# Altium project Digital_Tape.PrjPcb
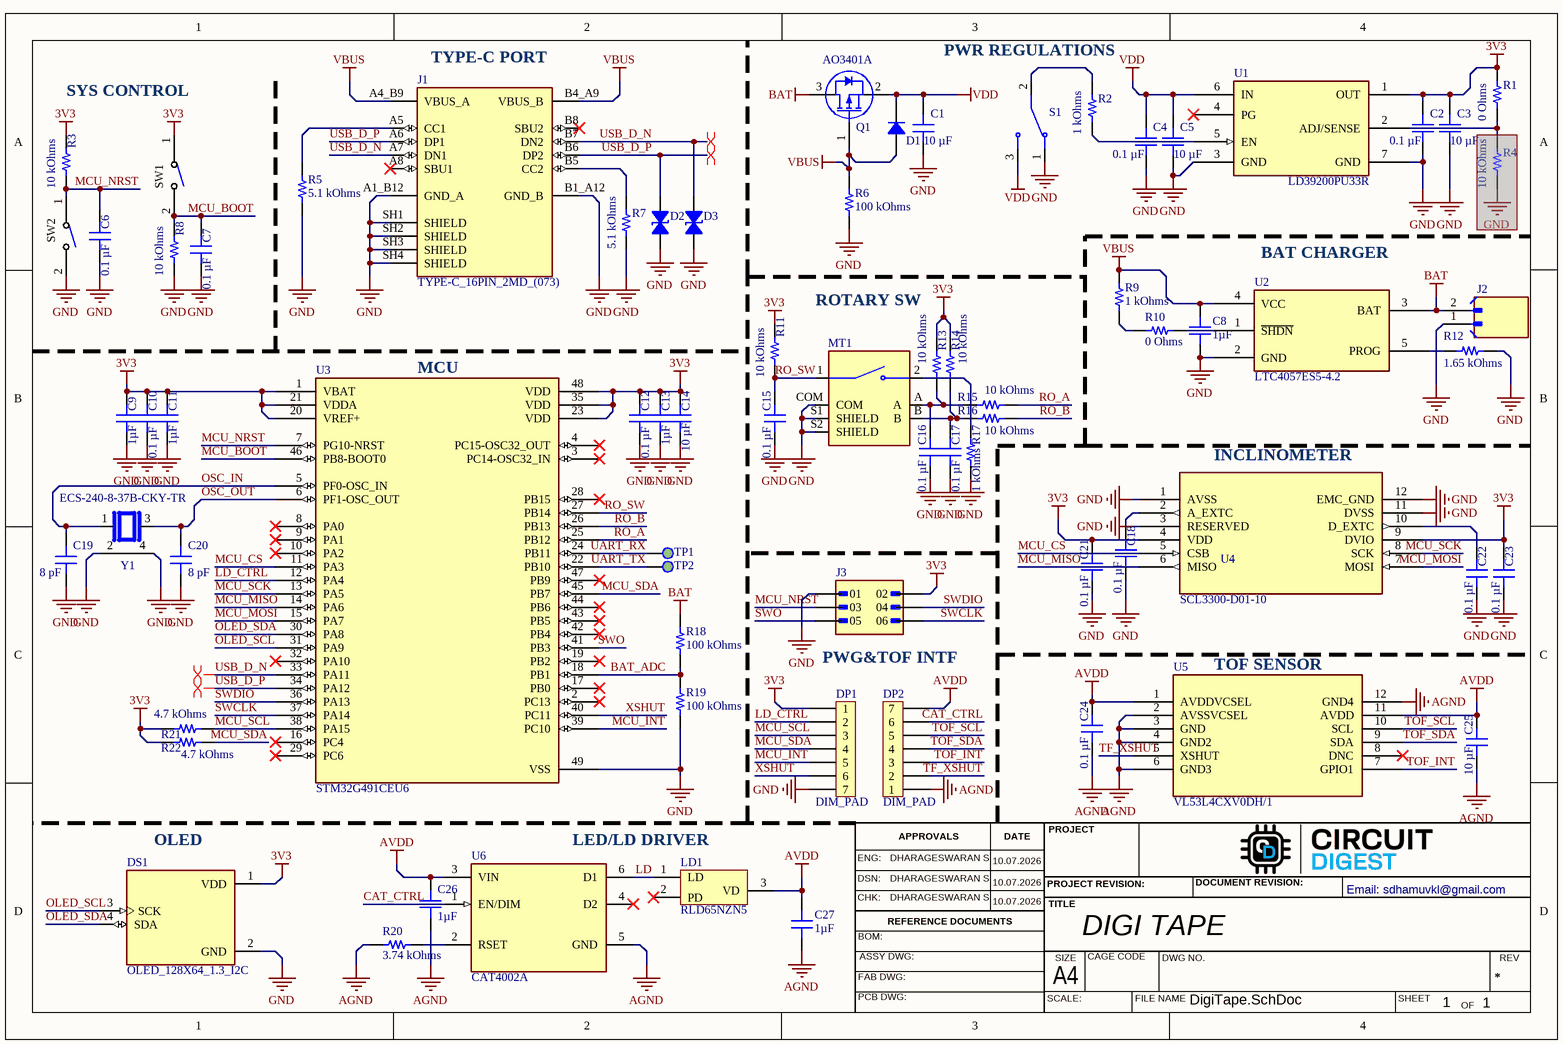
[diagram p0: DigiTape.SchDoc]
1 sheet, 73 parts. Net scope: global (net labels, ports and power ports of the same name join across sheets).
Board file: DigiTape.PcbDoc

## Sheet DigiTape.SchDoc: DIGI TAPE
size A4; Date: 10.07.2026; SheetNumber: 1; SheetTotal: 1

### Parts
C1  10 µF  [CAP 0603_1608]
C2  0.1 µF  [CAP 0603_1608]
C3  10 µF  [CAP 0603_1608]
C4  0.1 µF  [CAP 0603_1608]
C5  10 µF  [CAP 0603_1608]
C6  0.1 µF  [CAP 0603_1608]
C7  0.1 µF  [CAP 0603_1608]
C8  1µF  [CAP 0603_1608]
C9  1µF  [CAP 0603_1608]
C10  0.1 µF  [CAP 0603_1608]
C11  1µF  [CAP 0603_1608]
C12  0.1 µF  [CAP 0603_1608]
C13  1µF  [CAP 0603_1608]
C14  10 µF  [CAP 0603_1608]
C15  0.1 µF  [CAP 0603_1608]
C16  0.1 µF  [CAP 0603_1608]
C17  0.1 µF  [CAP 0603_1608]
C18  0.1 µF  [CAP 0603_1608]
C19  8 pF  [CAP 0603_1608]
C20  8 pF  [CAP 0603_1608]
C21  0.1 µF  [CAP 0603_1608]
C22  0.1 µF  [CAP 0603_1608]
C23  0.1 µF  [CAP 0603_1608]
C24  0.1 µF  [CAP 0603_1608]
C25  10 µF  [CAP 0603_1608]
C26  1µF  [CAP 0603_1608]
C27  1µF  [CAP 0603_1608]
D1  CUS10S30,H3F  [SOD323]  (value not drawn)
D2  GG0402060R3C2P  [0402]  (value not drawn)
D3  GG0402060R3C2P  [0402]  (value not drawn)
DP1  DIM_PAD  [DIM_PAD]
DP2  DIM_PAD  [DIM_PAD]
DS1  OLED_128X64_1.3_I2C  [LCD_OLED_128X64_1.3_I2C]
J1  TYPE-C_16PIN_2MD_(073)  [SHOUHAN_TYPE-C_16PIN_2MD_(073)]
J2  B2B-PH-K-S(LF)(SN)  [JST_B2B-PH-K-S(LF)(SN)]  (value not drawn)
J3  TSHC-103-D-171-16-264-F-LF  [MLE_TSHC-103-D-171-16-264-F-LF]  (value not drawn)
LD1  RLD65NZN5  [RLD65NZN5]
MT1  PEC11R-4215F-S0024  [XDCR_PEC11R-4215F-S0024]  (value not drawn)
Q1  AO3401A  [AO-SOT-23-3L_V]
R1  0 Ohms  [RES 0603_1608]
R2  1 kOhms  [RES 0603_1608]
R3  10 kOhms  [RES 0603_1608]
R4  10 kOhms  [RES 0402_1005]  (masked out: inside a compile mask, not in the netlist)
R5  5.1 kOhms  [RES 0603_1608]
R6  100 kOhms  [RES 0603_1608]
R7  5.1 kOhms  [RES 0603_1608]
R8  10 kOhms  [RES 0603_1608]
R9  1 kOhms  [RES 0603_1608]
R10  0 Ohms  [RES 0603_1608]
R11  10 kOhms  [RES 0603_1608]
R12  1.65 kOhms  [RES 0603_1608]
R13  10 kOhms  [RES 0603_1608]
R14  10 kOhms  [RES 0603_1608]
R15  10 kOhms  [RES 0603_1608]
R16  10 kOhms  [RES 0603_1608]
R17  1 kOhms  [RES 0603_1608]
R18  100 kOhms  [RES 0603_1608]
R19  100 kOhms  [RES 0603_1608]
R20  3.74 kOhms  [RES 0603_1608]
R21  4.7 kOhms  [RES 0603_1608]
R22  4.7 kOhms  [RES 0603_1608]
S1  EG1215AA  [SW_EG1215AA]  (value not drawn)
SW1  TS-1088-AR02016  [SW-SMD_L3.9-W3.0-P4.45]  (value not drawn)
SW2  TS-1088-AR02016  [SW-SMD_L3.9-W3.0-P4.45]  (value not drawn)
TP1  ROUND PAD 1.5MM  [ROUND PAD 1.5MM]  (value not drawn)
TP2  ROUND PAD 1.5MM  [ROUND PAD 1.5MM]  (value not drawn)
U1  LD39200PU33R  [SON_DFN6_3X3_STM]
U2  LTC4057ES5-4.2  [S_5_ADI]
U3  STM32G491CEU6  [QFPN_491CEU6_STM]
U4  SCL3300-D01-10  [SCL3300-D01-10_MUR]
U5  VL53L4CXV0DH/1  [LGA12_STM]
U6  CAT4002A  [CAT4002A]
Y1  ECS-240-8-37B-CKY-TR  [XTAL_ECS-160-9-37-CKM-TR]

### Nets
3V3: C2.2 C3.2 C9.2 C10.2 C11.2 C12.2 C13.2 C14.2 C21.2 C23.2 DP1.1 DS1.1(VDD) J3.02 R1.2 R3.2 R11.2 R13.2 R14.2 R21.2 R22.2 SW1.1 U1.1(OUT) U3.1(VBAT) U3.20(VREF+) U3.21(VDDA) U3.23(VDD) U3.35(VDD) U3.48(VDD) U4.4(VDD) U4.9(DVIO)
AGND: C24.1 C25.1 C26.1 C27.1 DP2.1 R20.1 U5.2(AVSSVCSEL) U5.3(GND) U5.4(GND2) U5.6(GND3) U5.12(GND4) U6.5(GND)
AVDD: C24.2 C25.2 C26.2 C27.2 DP2.7 LD1.3(VD) U5.1(AVDDVCSEL) U5.11(AVDD) U6.3(VIN)
BAT: J2.2 Q1.3(DRAIN) R18.2 U2.3(BAT)
GND: C1.1 C2.1 C3.1 C4.1 C5.1 C6.1 C7.1 C8.1 C9.1 C10.1 C11.1 C12.1 C13.1 C14.1 C15.1 C16.1 C17.1 C18.1 C19.1 C20.1 C21.1 C22.1 C23.1 D2.1 D3.1 DP1.7 DS1.2(GND) J1.A1_B12(GND_A) J1.B1_A12(GND_B) J1.SH1(SHIELD) J1.SH2(SHIELD) J1.SH3(SHIELD) J1.SH4(SHIELD) J2.1 J3.01 MT1.COM MT1.S1(SHIELD) MT1.S2(SHIELD) R5.1 R6.1 R7.1 R8.1 R12.1 R17.1 R19.1 S1.1 SW2.2 U1.3(GND) U1.7(GND) U2.2(GND) U3.49(VSS) U4.1(AVSS) U4.3(RESERVED) U4.11(DVSS) U4.12(EMC_GND) Y1.2 Y1.4
VBUS: C8.2 D1.1 J1.A4_B9(VBUS_A) J1.B4_A9(VBUS_B) Q1.1(GATE) R6.2 R9.2 U2.4(VCC)
VDD: C1.2 C4.2 C5.2 D1.2 Q1.2(SOURCE) S1.3 U1.6(IN)
BAT_ADC: R18.1 R19.2 U3.18(PB1)
CAT_CTRL: DP2.6 U6.1(EN/DIM)
LD: LD1.1(LD) U6.6(D1)
LD_CTRL: DP1.2 U3.12(PA4)
MCU_BOOT: C7.2 R8.2 SW1.2 U3.46(PB8-BOOT0)
MCU_CS: U3.11(PA3) U4.5(CSB)
MCU_INT: DP1.5 U3.39(PC10)
MCU_MISO: U3.14(PA6) U4.6(MISO)
MCU_MOSI: U3.15(PA7) U4.7(MOSI)
MCU_NRST: C6.2 J3.03 R3.1 SW2.1 U3.7(PG10-NRST)
MCU_SCK: U3.13(PA5) U4.8(SCK)
MCU_SCL: DP1.3 R21.1 U3.38(PA15)
MCU_SDA: DP1.4 R22.1 U3.45(PB7)
OLED_SCL: DS1.3(SCK) U3.31(PA9)
OLED_SDA: DS1.4(SDA) U3.30(PA8)
OSC_IN: C19.2 U3.5(PF0-OSC_IN) Y1.1
OSC_OUT: C20.2 U3.6(PF1-OSC_OUT) Y1.3
RO_A: R15.2 U3.25(PB12)
RO_B: R16.2 U3.26(PB13)
RO_SW: C15.2 MT1.1 R11.1 U3.27(PB14)
SWCLK: J3.06 U3.37(PA14)
SWDIO: J3.04 U3.36(PA13)
SWO: J3.05 U3.41(PB3)
TF_XSHUT: DP2.2 U5.5(XSHUT)
TOF_INT: DP2.3 U5.7(GPIO1)
TOF_SCL: DP2.5 U5.10(SCL)
TOF_SDA: DP2.4 U5.9(SDA)
UART_RX: TP1.1 U3.24(PB11)
UART_TX: TP2.1 U3.22(PB10)
USB_D_N: D3.2 J1.A7(DN1) J1.B7(DN2) U3.33(PA11)
USB_D_P: D2.2 J1.A6(DP1) J1.B6(DP2) U3.34(PA12)
XSHUT: DP1.6 U3.40(PC11)
NetC16_2: C16.2 MT1.A R13.1 R15.1
NetC17_2: C17.2 MT1.B R14.1 R16.1
NetC18_2: C18.2 U4.2(A_EXTC)
NetC22_2: C22.2 U4.10(D_EXTC)
NetJ1_A5: J1.A5(CC1) R5.2
NetJ1_B5: J1.B5(CC2) R7.2
NetMT1_2: MT1.2 R17.2
NetR1_1: R1.1 U1.2(ADJ/SENSE)
NetR2_1: R2.1 U1.5(EN)
NetR2_2: R2.2 S1.2
NetR9_1: R9.1 R10.1
NetR10_2: R10.2 U2.1(~{SHDN})
NetR12_2: R12.2 U2.5(PROG)
NetR20_2: R20.2 U6.2(RSET)

Not connected (* = marked no-connect by the designer): J1 A8(SBU1)* B8(SBU2)*; LD1 2(PD)*; U1 4(PG)*; U3 2(PC13)* 3(PC14-OSC32_IN)* 4(PC15-OSC32_OUT)* 8(PA0)* 9(PA1)* 10(PA2)* 16(PC4)* 17(PB0)* 19(PB2)* 28(PB15)* 29(PC6)* 32(PA10)* 42(PB4)* 43(PB5)* 44(PB6)* 47(PB9)*; U5 8(DNC)*; U6 4(D2)*

### Layout directives
differential pair: USB_D_N, USB_D_P

### Notes on the sheet
- SYS CONTROL
- (near J1) TYPE-C PORT
- PWR REGULATIONS
- (near U2) BAT CHARGER
- ROTARY SW
- (near U3) MCU
- (near U4) INCLINOMETER
- PWG&TOF INTF
- (near U5) TOF SENSOR
- (near DS1) OLED
- LED/LD DRIVER
- ENG:
- DHARAGESWARAN S
- APPROVALS
- DATE
- PROJECT
- DSN:
- CHK:
- REFERENCE DOCUMENTS
- PROJECT REVISION:
- TITLE
- DOCUMENT REVISION:
- Email: sdhamuvkl@gmail.com <https://github.com/DhamuVkl>
- BOM:
- FAB DWG:
- PCB DWG:
- ASSY DWG:
- SCALE:
- A4
- SIZE
- CAGE CODE
- FILE NAME
- DWG NO.
- SHEET
- REV
- OF

### Library data of the parts
C1 C3 C5 C14 C25 = GMC10X7R106M6R3NT: CAP0603 X7R 10UF 20% 6.3V; Manufacturer: Cal-Chip Electronics, Inc.; id: 9373; Part Number: GMC10X7R106M6R3NT; Value: 10 µF; Temperature Coefficient: X7R; Supplier Part Number 1: 4713-GMC10X7R106M6R3NTCT-ND; ComponentLink2Description: DigiKey Link; ComponentLink1URL: https://88ce57.p3cdn1.secureserver.net/wp-content/uploads/2023/01/gmc_series-2.pdf; PartId: 49831; Tolerance: ±20%; Supplier 1: DigiKey; Series: GMC; LastUpdated: 2023-04-21T19:07:51.070; Part Status: Active; Capacitance: 10 µF; Device Package: 0603 (1608 Metric); Thickness (Max): 0.039" (1.00mm); Voltage - Rated: 6.3V; Minimum Order: 1; Packaging: TapeAndReel; Applications: General Purpose; Package / Case: 0603 (1608 Metric); ComponentLink1Description: Datasheet; Price: 0.14; ComponentLink2URL: https://www.digikey.com/en/products/detail/cal-chip-electronics-inc/GMC10X7R106M6R3NT/18151153; Lifecycle Status: Active; Operating Temperature: -55°C ~ 125°C; Size / Dimension: 0.063" L x 0.031" W (1.60mm x 0.80mm); Mounting Type: Surface Mount, MLCC
C2 C4 C6 C7 C10 C12 C15-C18 C21-C24 = CS0603KRX7R7BB104: CAP CER 0.1UF 16V X7R 0603; Manufacturer: Yageo; id: 56; Tolerance: ±10%; Part Number: CS0603KRX7R7BB104; Value: 0.1 µF; Temperature Coefficient: X7R; Supplier Part Number 1: 311-3560-1-ND; ComponentLink2Description: DigiKey Link; ComponentLink1URL: http://www.yageo.com/NewPortal/yageodocoutput?fileName=/pdf/MLCC/UPY-ST_NPOX7R_16V-to-3KV_5.pdf; PartId: 2286; Supplier 1: DigiKey; Series: CS; LastUpdated: 2023-01-03T20:07:47.973; Part Status: Active; Capacitance: 0.1 µF; Device Package: 0603 (1608 Metric); Thickness (Max): 0.037" (0.95mm); Voltage - Rated: 16V; Minimum Order: 1; Packaging: TapeAndReel; Applications: Boardflex Sensitive; Package / Case: 0603 (1608 Metric); ComponentLink1Description: Datasheet; Price: 0.02; ComponentLink2URL: https://www.digikey.com/en/products/detail/yageo/CS0603KRX7R7BB104/6097897; Lifecycle Status: Active; Operating Temperature: -55°C ~ 125°C; Size / Dimension: 0.063" L x 0.031" W (1.60mm x 0.80mm); Mounting Type: Surface Mount, MLCC; Features: Soft Termination
C8 C9 C11 C13 C26 C27 = 0603ZG105ZAT2A: CAP CER 1UF 10V Y5V 0603; Manufacturer: AVX Corporation; id: 522; Temperature Coefficient: Y5V (F); Tolerance: -20%, +80%; Part Number: 0603ZG105ZAT2A; Value: 1µF; Supplier Part Number 1: 478-1265-1-ND; ComponentLink2Description: DigiKey Link; ComponentLink1URL: http://datasheets.avx.com/Y5V.pdf; PartId: 4251; Supplier 1: DigiKey; Series: -; LastUpdated: 2020-09-02T01:03:32.277; Part Status: Active; Capacitance: 1µF; Device Package: 0603 (1608 Metric); Thickness (Max): 0.035" (0.90mm); Voltage - Rated: 10V; Minimum Order: 1; Packaging: TapeAndReel; Applications: General Purpose; Package / Case: 0603 (1608 Metric); ComponentLink1Description: Datasheet; Price: 0.02; ComponentLink2URL: http://digikey.com/product-detail/en/avx-corporation/0603ZG105ZAT2A/478-1265-1-ND/564297; Lifecycle Status: Active; Operating Temperature: -30°C ~ 85°C; Size / Dimension: 0.063" L x 0.032" W (1.60mm x 0.81mm); Mounting Type: Surface Mount, MLCC
C19 C20 = CGA3E2C0G1H080D080AD: CAP CER 8PF 50V 0603 EPOXY; Manufacturer: TDK Corporation; id: 983; Temperature Coefficient: C0G, NP0; Tolerance: ±0.5pF; Part Number: CGA3E2C0G1H080D080AD; Value: 8 pF; Supplier Part Number 1: 445-9807-1-ND; ComponentLink2Description: DigiKey Link; ComponentLink1URL: https://product.tdk.com/info/en/catalog/datasheets/mlcc_automotive_epoxy_en.pdf?ref_disty=digikey; PartId: 6342; Supplier 1: DigiKey; Series: CGA; LastUpdated: 2023-01-03T20:07:37.107; Part Status: Active; Capacitance: 8 pF; Device Package: 0603 (1608 Metric); Ratings: AEC-Q200; Thickness (Max): 0.037" (0.95mm); Voltage - Rated: 50V; Minimum Order: 1; Packaging: TapeAndReel; Applications: Automotive; Package / Case: 0603 (1608 Metric); ComponentLink1Description: Datasheet; Price: 0.02; ComponentLink2URL: https://www.digikey.com/en/products/detail/tdk-corporation/CGA3E2C0G1H080D080AD/3933540; Lifecycle Status: Active; Operating Temperature: -55°C ~ 125°C; Size / Dimension: 0.063" L x 0.031" W (1.60mm x 0.80mm); Mounting Type: Surface Mount, MLCC, Epoxy; Features: Epoxy Mountable
D1 = CUS10S30,H3F: DIODE SCHOTTKY 30V 1A USC; Manufacturer: Toshiba Semiconductor and Storage; id: 3067; Capacitance @ Vr, F: 135pF @ 0V, 1MHz; Speed: Fast Recovery =< 500ns, > 200mA (Io); Voltage - Forward (Vf) (Max) @ If: 230 mV @ 100 mA; Current - Reverse Leakage @ Vr: 500 µA @ 30 V; Part Number: CUS10S30,H3F; Supplier Part Number 1: CUS10S30H3FCT-ND; Supplier Device Package: USC; ComponentLink1Description: Datasheet; ComponentLink2URL: https://www.digikey.com/en/products/detail/toshiba-semiconductor-and-storage/CUS10S30-H3F/5114299; ComponentLink1URL: https://toshiba.semicon-storage.com/info/docget.jsp?did=14077&prodName=CUS10S30; Supplier 1: DigiKey; Series: -; Part Status: Active; ComponentLink2Description: DigiKey Link; Current - Average Rectified (Io): 1A; Operating Temperature - Junction: 125°C (Max); Diode Type: Schottky; Packaging: TapeAndReel; Minimum Order: 1; Voltage - DC Reverse (Vr) (Max): 30 V; Package / Case: SC-76, SOD-323; PartId: 3067; Lifecycle Status: Active; LastUpdated: 2023-01-02T21:07:53.950; Mounting Type: Surface Mount; Price: 0.05
D2 D3 = GG0402060R3C2P: TVS DIODE 6.5VWM 15.5VC 0402; Manufacturer: KYOCERA AVX; id: 6041; Voltage - Breakdown (Min): 7V; Voltage - Reverse Standoff (Typ): 6.5V; Voltage - Clamping (Max) @ Ipp: 15.5V; Power Line Protection: No; Bidirectional Channels: 1; Capacitance @ Frequency: 0.3pF @ 1MHz; Type: Zener; Current - Peak Pulse (10/1000µs): 3A (8/20µs); Power - Peak Pulse: 54W; Part Number: GG0402060R3C2P; Supplier Part Number 1: 478-GG0402060R3C2PCT-ND; Supplier Device Package: 0402; ComponentLink1Description: Datasheet; ComponentLink2URL: https://www.digikey.com/en/products/detail/kyocera-avx/GG0402060R3C2P/13557242; ComponentLink1URL: https://datasheets.kyocera-avx.com/AVX-GiGuard.pdf; Supplier 1: DigiKey; Series: GiGUARD; Part Status: Active; ComponentLink2Description: DigiKey Link; Device Package: 0402 (1005 Metric); Packaging: TapeAndReel; Minimum Order: 1; Applications: Ethernet, HDMI, USB; Package / Case: 0402 (1005 Metric); PartId: 11515; Lifecycle Status: Active; LastUpdated: 2023-01-02T21:10:15.003; Operating Temperature: -55°C ~ 125°C; Mounting Type: Surface Mount; Price: 0.03
DS1 = OLED_128X64_1.3_I2C: Non-Touch Graphic LCD Display Module Transmissive White OLED, Monochrome I2C 1.3 (33.02mm) 128 x 64; MF: UNIVERSAL-SOLDER Electronics Ltd; MP: OLED 128x64 1.3&quot; I2C; SnapEDA_Link: https://www.snapeda.com/parts/OLED%20128x64%201.3%22%20I2C/UNIVERSAL-SOLDER+Electronics+Ltd/view-part/?ref=snap; Package: None; Value: *; Check_prices: https://www.snapeda.com/parts/OLED%20128x64%201.3%22%20I2C/UNIVERSAL-SOLDER+Electronics+Ltd/view-part/?ref=eda
J1 = TYPE-C_16PIN_2MD_(073): DC-5V 5A Type C USB; MF: Shouhan; MP: TYPE-C 16PIN 2MD (073); SnapEDA_Link: https://www.snapeda.com/parts/TYPE-C%2016PIN%202MD%20(073)/Shouhan/view-part/?ref=snap; Package: Package; Value: *; Check_prices: https://www.snapeda.com/parts/TYPE-C%2016PIN%202MD%20(073)/Shouhan/view-part/?ref=eda
J2 = B2B-PH-K-S(LF)(SN): Connector Header Through Hole 2 position 0.079 (2.00mm); MF: JST; SnapEDA_Link: https://www.snapeda.com/parts/B2B-PH-K-S%20(LF)(SN)/JST/view-part/?ref=snap; Package: None; Value: *; MP: B2B-PH-K-S (LF)(SN); Check_prices: https://www.snapeda.com/parts/B2B-PH-K-S%20(LF)(SN)/JST/view-part/?ref=eda
J3 = TSHC-103-D-171-16-264-F-LF: 6 Position Dual Row (3x2) 2.54mm Pitch Non-Shrouded Header; MF: Major League Electronics; SnapEDA_Link: https://www.snapeda.com/parts/TSHC-103-D-171-16-264-F-LF/Major+League+Electronics/view-part/?ref=snap; Package: None; Value: *; MP: TSHC-103-D-171-16-264-F-LF; Check_prices: https://www.snapeda.com/parts/TSHC-103-D-171-16-264-F-LF/Major+League+Electronics/view-part/?ref=eda
MT1 = PEC11R-4215F-S0024: Incremental Encoder, 12 Mm, Contact Rating 10 Ma - 5 Vdc; Price: None; Availability: Unavailable; MP: PEC11R-4215F-S0024; Value: *; Package: None
Q1 = CMP-2000-05778-1: P-Channel MOSFET, 30 V, 4 A, -55 to 150 degC, 3-Pin SOT-23-3L, RoHS, Tape and Reel; Manufacturer: Alpha and Omega; Output Power (Max): NotRequiredW; Power Dissipation: 1.4W; Rad Hardened: No; Drain Efficiency: NotRequired%; Drain-Source On-Volt: 30V; Noise Figure: NotRequireddB; Frequency (Max): NotRequiredMHz; Number of  Elements: 1; Gate-Source Voltage (Max): ?12V; Drain Current (Max): 4A; Channel Mode: Enhancement; Drain-Source On-Res: 0.044ohm; Type: PowerMOSFET; Polarity: P; Package URL: http://www.aosmd.com/res/packaging_information/SOT-23-3L.pdf; Datasheet URL: http://www.aosmd.com/res/data_sheets/AO3401A.pdf; Package Type: SOT-23; Package Description: 3-Pin Small Outline Transistor, Body 2.95 x 1.6 mm, Pitch 0.95 mm; Mounting: SurfaceMount; Manufacturer URL: http://www.aosmd.com/; Continuous Drain Current: 4A; Package Reference: SOT-23-3L; Mounting Technology: SurfaceMount; Operating Temperature Classification: Military; Power Gain: NotRequireddB; Datasheet Version: Rev. 3, 03/2011; Operating Temp Range: -55Cto150C; Pin Count: 3
R1 = RT0603BRD0756KL: RES SMD 56K OHM 0.1% 1/10W 0603; Manufacturer: Yageo; id: 2137; Temperature Coefficient: ±25ppm/°C; Value: 56 kOhms; Power (Watts): 0.1W, 1/10W; Part Number: RT0603BRD0756KL; Height - Seated (Max): 0.022" (0.55mm); Supplier Part Number 1: YAG4576CT-ND; Supplier Device Package: 0603; ComponentLink1Description: Datasheet; ComponentLink2URL: https://www.digikey.com/en/products/detail/yageo/RT0603BRD0756KL/1072582; ComponentLink1URL: https://www.yageo.com/upload/media/product/productsearch/datasheet/rchip/PYu-RT_1-to-0.01_RoHS_L_11.pdf; Composition: Thin Film; Tolerance: ±0.1%; Supplier 1: DigiKey; Series: RT; Part Status: Active; ComponentLink2Description: DigiKey Link; Device Package: 0603 (1608 Metric); Packaging: TapeAndReel; Minimum Order: 1; Package / Case: 0603 (1608 Metric); PartId: 9254; Lifecycle Status: Active; LastUpdated: 2023-01-02T20:30:09.580; Operating Temperature: -55°C ~ 155°C; Number Of Terminations: 2; Size / Dimension: 0.063" L x 0.031" W (1.60mm x 0.80mm); Price: 0.04; Resistance: 56 kOhms
R2 R9 R17 = CPF0603B1K0E: RES SMD 1K OHM 0.1% 1/16W 0603; Manufacturer: TE Connectivity Passive Product; id: 16; Temperature Coefficient: ±25ppm/°C; Power (Watts): 0.063W, 1/16W; Part Number: CPF0603B1K0E; Height - Seated (Max): 0.022" (0.55mm); Supplier Part Number 1: A119887CT-ND; Supplier Device Package: 0603; ComponentLink1Description: Datasheet; ComponentLink2URL: https://www.digikey.com/en/products/detail/te-connectivity-passive-product/CPF0603B1K0E/2390473; ComponentLink1URL: https://www.te.com/commerce/DocumentDelivery/DDEController?Action=srchrtrv&DocNm=1773200&DocType=DS&DocLang=English; Composition: Thin Film; Tolerance: ±0.1%; Supplier 1: DigiKey; Series: CPF, Neohm; Part Status: Active; ComponentLink2Description: DigiKey Link; Device Package: 0603 (1608 Metric); Packaging: TapeAndReel; Minimum Order: 1; Package / Case: 0603 (1608 Metric); PartId: 4877; Lifecycle Status: Active; LastUpdated: 2023-01-02T20:30:26.897; Operating Temperature: -55°C ~ 155°C; Number Of Terminations: 2; Value: 1 kOhms; Size / Dimension: 0.061" L x 0.031" W (1.55mm x 0.80mm); Price: 0.09; Resistance: 1 kOhms
R3 R8 R11 R13-R16 = RNCS0603BKE10K0: RES 10K OHM 0.1% 1/16W 0603; Manufacturer: Stackpole Electronics Inc; id: 1; Temperature Coefficient: ±25ppm/°C; Power (Watts): 0.063W, 1/16W; Part Number: RNCS0603BKE10K0; Height - Seated (Max): 0.022" (0.55mm); Supplier Part Number 1: RNCS0603BKE10K0CT-ND; Supplier Device Package: 0603; ComponentLink1Description: Datasheet; ComponentLink2URL: https://www.digikey.com/en/products/detail/stackpole-electronics-inc/RNCS0603BKE10K0/1708836; ComponentLink1URL: https://www.seielect.com/catalog/sei-rncs_rnch.pdf; Composition: Thin Film; Tolerance: ±0.1%; Supplier 1: DigiKey; Series: RNCS; Part Status: Active; ComponentLink2Description: DigiKey Link; Device Package: 0603 (1608 Metric); Packaging: TapeAndReel; Minimum Order: 1; Package / Case: 0603 (1608 Metric); PartId: 4838; Lifecycle Status: Active; LastUpdated: 2023-01-02T20:30:27.037; Operating Temperature: -55°C ~ 155°C; Number Of Terminations: 2; Value: 10 kOhms; Size / Dimension: 0.061" L x 0.031" W (1.55mm x 0.80mm); Price: 0.07; Resistance: 10 kOhms; Features: Anti-Corrosive, Automotive AEC-Q200, Moisture Resistant; Ratings: AEC-Q200
R4 = RT0402BRE0710KL: RES SMD 10K OHM 0.1% 1/16W 0402; Manufacturer: Yageo; id: 1919; Temperature Coefficient: ±50ppm/°C; Power (Watts): 0.063W, 1/16W; Part Number: RT0402BRE0710KL; Height - Seated (Max): 0.014" (0.35mm); Supplier Part Number 1: YAG2305CT-ND; Supplier Device Package: 0402; ComponentLink1Description: Datasheet; ComponentLink2URL: https://www.digikey.com/en/products/detail/yageo/RT0402BRE0710KL/1069451; ComponentLink1URL: https://www.yageo.com/upload/media/product/productsearch/datasheet/rchip/PYu-RT_1-to-0.01_RoHS_L_11.pdf; Composition: Thin Film; Tolerance: ±0.1%; Supplier 1: DigiKey; Series: RT; Part Status: Active; ComponentLink2Description: DigiKey Link; Device Package: 0402 (1005 Metric); Packaging: TapeAndReel; Minimum Order: 1; Package / Case: 0402 (1005 Metric); PartId: 6060; Lifecycle Status: Active; LastUpdated: 2023-01-02T20:21:36.193; Operating Temperature: -55°C ~ 155°C; Number Of Terminations: 2; Value: 10 kOhms; Size / Dimension: 0.039" L x 0.020" W (1.00mm x 0.50mm); Price: 0.04; Resistance: 10 kOhms
R5 R7 = RMCF0603JG5K10: RES 5.1K OHM 5% 1/10W 0603; Manufacturer: Stackpole Electronics Inc; id: 158; Temperature Coefficient: ±200ppm/°C; Power (Watts): 0.1W, 1/10W; Part Number: RMCF0603JG5K10; Height - Seated (Max): 0.022" (0.55mm); Supplier Part Number 1: RMCF0603JG5K10CT-ND; Supplier Device Package: 0603; ComponentLink1Description: Datasheet; ComponentLink2URL: https://www.digikey.com/en/products/detail/stackpole-electronics-inc/RMCF0603JG5K10/1712287; Features: Automotive AEC-Q200; ComponentLink1URL: https://www.seielect.com/catalog/sei-packaging.pdf; Composition: Thick Film; Tolerance: ±5%; Supplier 1: DigiKey; Series: RMCF; Part Status: Active; ComponentLink2Description: DigiKey Link; Device Package: 0603 (1608 Metric); Packaging: CutTape; Ratings: AEC-Q200; Minimum Order: 1; Package / Case: 0603 (1608 Metric); PartId: 5180; Lifecycle Status: Active; LastUpdated: 2023-01-02T20:30:25.707; Operating Temperature: -55°C ~ 155°C; Number Of Terminations: 2; Value: 5.1 kOhms; Size / Dimension: 0.061" L x 0.031" W (1.55mm x 0.80mm); Price: 0.01; Resistance: 5.1 kOhms
R6 R18 R19 = RNCS0603BKE100K: RES 100K OHM 0.1% 1/16W 0603; Manufacturer: Stackpole Electronics Inc; id: 6; Temperature Coefficient: ±25ppm/°C; Power (Watts): 0.063W, 1/16W; Part Number: RNCS0603BKE100K; Height - Seated (Max): 0.022" (0.55mm); Supplier Part Number 1: RNCS0603BKE100KCT-ND; Supplier Device Package: 0603; ComponentLink1Description: Datasheet; ComponentLink2URL: https://www.digikey.com/en/products/detail/stackpole-electronics-inc/RNCS0603BKE100K/1708835; Features: Anti-Corrosive, Automotive AEC-Q200, Moisture Resistant; ComponentLink1URL: https://www.seielect.com/catalog/sei-rncs_rnch.pdf; Composition: Thin Film; Tolerance: ±0.1%; Supplier 1: DigiKey; Series: RNCS; Part Status: Active; ComponentLink2Description: DigiKey Link; Device Package: 0603 (1608 Metric); Packaging: TapeAndReel; Ratings: AEC-Q200; Minimum Order: 1; Package / Case: 0603 (1608 Metric); PartId: 4849; Lifecycle Status: Active; LastUpdated: 2023-01-02T20:30:27; Operating Temperature: -55°C ~ 155°C; Number Of Terminations: 2; Value: 100 kOhms; Size / Dimension: 0.061" L x 0.031" W (1.55mm x 0.80mm); Price: 0.08; Resistance: 100 kOhms
R10 = PA0603-R-070RL: RES 0 OHM JUMPER 1/10W 0603; Manufacturer: Yageo; id: 11; Power (Watts): 0.1W, 1/10W; Temperature Coefficient: ±150ppm/°C; Part Number: PA0603-R-070RL; Height - Seated (Max): 0.024" (0.60mm); Supplier Part Number 1: YAG5757CT-ND; Supplier Device Package: 0603; ComponentLink1Description: Datasheet; ComponentLink2URL: https://www.digikey.com/en/products/detail/yageo/PA0603-R-070RL/8255972; Features: Automotive AEC-Q200, Current Sense; ComponentLink1URL: http://www.yageo.com/NewPortal/_en/search/productDocs.jsp?YageoPartNumber=PA0603-R-070RL; Composition: Metal Element; Tolerance: Jumper; Supplier 1: DigiKey; Series: PA; Part Status: Active; ComponentLink2Description: DigiKey Link; Device Package: 0603 (1608 Metric); Packaging: TapeAndReel; Minimum Order: 1; Package / Case: 0603 (1608 Metric); PartId: 4862; Lifecycle Status: Active; LastUpdated: 2023-01-02T20:30:26.940; Operating Temperature: -55°C ~ 155°C; Number Of Terminations: 2; Value: 0 Ohms; Size / Dimension: 0.063" L x 0.031" W (1.60mm x 0.80mm); Price: 0.08; Resistance: 0 Ohms
R12 = RC0603FR-071K65L: RES 1.65K OHM 1% 1/10W 0603; Manufacturer: Yageo; id: 1322; Temperature Coefficient: ±100ppm/°C; Power (Watts): 0.1W, 1/10W; Part Number: RC0603FR-071K65L; Height - Seated (Max): 0.022" (0.55mm); Supplier Part Number 1: 311-1.65KHRCT-ND; Supplier Device Package: 0603; ComponentLink1Description: Datasheet; ComponentLink2URL: https://www.digikey.com/en/products/detail/yageo/RC0603FR-071K65L/726870; Features: Moisture Resistant; ComponentLink1URL: https://www.yageo.com/upload/media/product/productsearch/datasheet/rchip/PYu-RC_Group_51_RoHS_L_10.pdf; Composition: Thick Film; Tolerance: ±1%; Supplier 1: DigiKey; Series: RC_L; Part Status: Active; ComponentLink2Description: DigiKey Link; Device Package: 0603 (1608 Metric); Packaging: CutTape; Minimum Order: 1; Package / Case: 0603 (1608 Metric); PartId: 7585; Lifecycle Status: Active; LastUpdated: 2023-01-02T20:30:16.083; Operating Temperature: -55°C ~ 155°C; Number Of Terminations: 2; Value: 1.65 kOhms; Size / Dimension: 0.063" L x 0.031" W (1.60mm x 0.80mm); Price: 0.01; Resistance: 1.65 kOhms
R20 = RNCF0603DTE3K74: RES 3.74K OHM 0.5% 1/10W 0603; Manufacturer: Stackpole Electronics Inc; id: 236; Temperature Coefficient: ±25ppm/°C; Power (Watts): 0.1W, 1/10W; Part Number: RNCF0603DTE3K74; Height - Seated (Max): 0.022" (0.55mm); Supplier Part Number 1: RNCF0603DTE3K74CT-ND; Supplier Device Package: 0603; ComponentLink1Description: Datasheet; ComponentLink2URL: https://www.digikey.com/en/products/detail/stackpole-electronics-inc/RNCF0603DTE3K74/6264039; ComponentLink1URL: https://www.seielect.com/catalog/sei-rncf.pdf; Composition: Thin Film; Tolerance: ±0.5%; Supplier 1: DigiKey; Series: RNCF; Part Status: Active; ComponentLink2Description: DigiKey Link; Device Package: 0603 (1608 Metric); Packaging: TapeAndReel; Minimum Order: 1; Package / Case: 0603 (1608 Metric); PartId: 5365; Lifecycle Status: Active; LastUpdated: 2023-01-02T20:30:25.090; Operating Temperature: -55°C ~ 155°C; Number Of Terminations: 2; Value: 3.74 kOhms; Size / Dimension: 0.061" L x 0.031" W (1.55mm x 0.80mm); Price: 0.01; Resistance: 3.74 kOhms; Features: Automotive AEC-Q200; Ratings: AEC-Q200
R21 R22 = RS73G1JTTD4701B: RES 4.7K OHM 0.1% 1/5W 0603; Manufacturer: KOA Speer Electronics, Inc.; id: 13121; Temperature Coefficient: ±50ppm/°C; Power (Watts): 0.2W, 1/5W; Part Number: RS73G1JTTD4701B; Height - Seated (Max): 0.022" (0.55mm); Supplier Part Number 1: 2019-RS73G1JTTD4701BCT-ND; Supplier Device Package: 0603; ComponentLink1Description: Datasheet; ComponentLink2URL: https://www.digikey.com/en/products/detail/koa-speer-electronics-inc/RS73G1JTTD4701B/11594383; Features: Automotive AEC-Q200, Moisture Resistant; ComponentLink1URL: http://www.koaspeer.com/pdfs/RS73.pdf; Composition: Thick Film; Tolerance: ±0.1%; Supplier 1: DigiKey; Series: RS73; Part Status: Active; ComponentLink2Description: DigiKey Link; Device Package: 0603 (1608 Metric); Packaging: TapeAndReel; Ratings: AEC-Q200; Minimum Order: 1; Package / Case: 0603 (1608 Metric); PartId: 56376; Lifecycle Status: Active; LastUpdated: 2023-01-02T20:28:25.247; Operating Temperature: -55°C ~ 155°C; Number Of Terminations: 2; Value: 4.7 kOhms; Size / Dimension: 0.063" L x 0.031" W (1.60mm x 0.80mm); Price: 0.08; Resistance: 4.7 kOhms
S1 = EG1215AA: Slide Switch SPDT Surface Mount, Right Angle; MF: E-Switch; SnapEDA_Link: https://www.snapeda.com/parts/EG1215AA/E-Switch/view-part/?ref=snap; Package: None; Value: *; MP: EG1215AA; Check_prices: https://www.snapeda.com/parts/EG1215AA/E-Switch/view-part/?ref=eda
SW1 SW2 = TS-1088-AR02016: Manufacturer: XUNPU(讯普); Add into BOM: yes; Circuit: SPST; Actuator Style: Round Button; Operating Force: 1.6N; Switch Height: 2mm; with Bracket: Without Bracket; Contact Current: 50mA; Voltage Rating: 12V; Actuator/Cap Color: Black; Life: 100,000 Cycles; Symbol: TS-1088-AR02016; Device: TS-1088-AR02016; LCSC Part Name: 4*3*2mm 立贴 轻触开关; Supplier Part: C720477; Manufacturer Part: TS-1088-AR02016; Supplier Footprint: SMD,4x3mm; JLCPCB Part Class: Basic Part; Datasheet: https://item.szlcsc.com/datasheet/TS-1088-AR02016/763484.html; Supplier: LCSC; Convert to PCB: yes; Mounting Type: Surface Mount,Vertical; Length: 4mm; Width: 3mm; Termination Style: SMD(SMT) Tab; Operating Temperature: -30℃~+80℃
U1 = LD39200PU33R: 2 A high PSRR ultra low drop linear regulator with reverse current protection; Manufacturer_Name: STMicroelectronics; Copyright: Copyright (C) 2026 Ultra Librarian. All rights reserved.; Manufacturer_Part_Number: LD39200PU33R; RefDes: RefDes; Type: Type
U2 = LTC4057ES5-4.2TRMPBF: Linear Li-Ion Battery Charger with Thermal Regulation in ThinSOT; Manufacturer_Name: Analog Devices Inc; Manufacturer_Part_Number: LTC4057ES5-4.2#TRMPBF; Copyright: Copyright (C) 2026 Ultra Librarian. All rights reserved.; RefDes: RefDes; Type: Type
U3 = STM32G491CEU6: Mainstream Arm Cortex-M4 MCU 170 MHz with 512 Kbytes of Flash memory, Math Accelerator, High Analog level integration; Manufacturer_Name: STMicroelectronics; Copyright: Copyright (C) 2026 Ultra Librarian. All rights reserved.; Manufacturer_Part_Number: STM32G491CEU6; RefDes: RefDes; Type: Type
U4 = SCL3300-D01-10: Description; Manufacturer_Name: Murata; Copyright: Copyright (C) 2025 Ultra Librarian. All rights reserved.; Manufacturer_Part_Number: SCL3300-D01-10; RefDes: RefDes; Type: Type
U5 = VL53L4CXV0DH1: Time-of-Flight (ToF) sensor with extended range measurement; Manufacturer_Name: STMicroelectronics; Copyright: Copyright (C) 2026 Ultra Librarian. All rights reserved.; Manufacturer_Part_Number: VL53L4CXV0DH/1; RefDes: RefDes; Type: Type
U6 = CAT4002A: 12-bit, single-channel, ultra-low power DAC in 6-pin SC70 package for battery powered applications; MF: Texas Instruments; MP: DAC7311IDCKR; SnapEDA_Link: https://www.snapeda.com/parts/DAC7311IDCKR/Texas+Instruments/view-part/?ref=snap; Package: SOT-SC70-6 Texas Instruments; Value: *; Check_prices: https://www.snapeda.com/parts/DAC7311IDCKR/Texas+Instruments/view-part/?ref=eda
Y1 = ECS-240-8-37B-CKY-TR: 24 MHz Â±10ppm Crystal 8pF 50 Ohms 4-SMD, No Lead; MF: ECS Inc.; SnapEDA_Link: https://www.snapeda.com/parts/ECS-240-8-37B-CKY-TR/ECS/view-part/?ref=snap; Package: ECX-1637B2-37B2-4 ECS; Value: *; MP: ECS-240-8-37B-CKY-TR; Check_prices: https://www.snapeda.com/parts/ECS-240-8-37B-CKY-TR/ECS/view-part/?ref=eda